# Altium schematic sheet MiniPC_Func.SchDoc: MiniPC Block Diagram
size D; DocumentNumber: 1; SheetNumber: 1; SheetTotal: 46
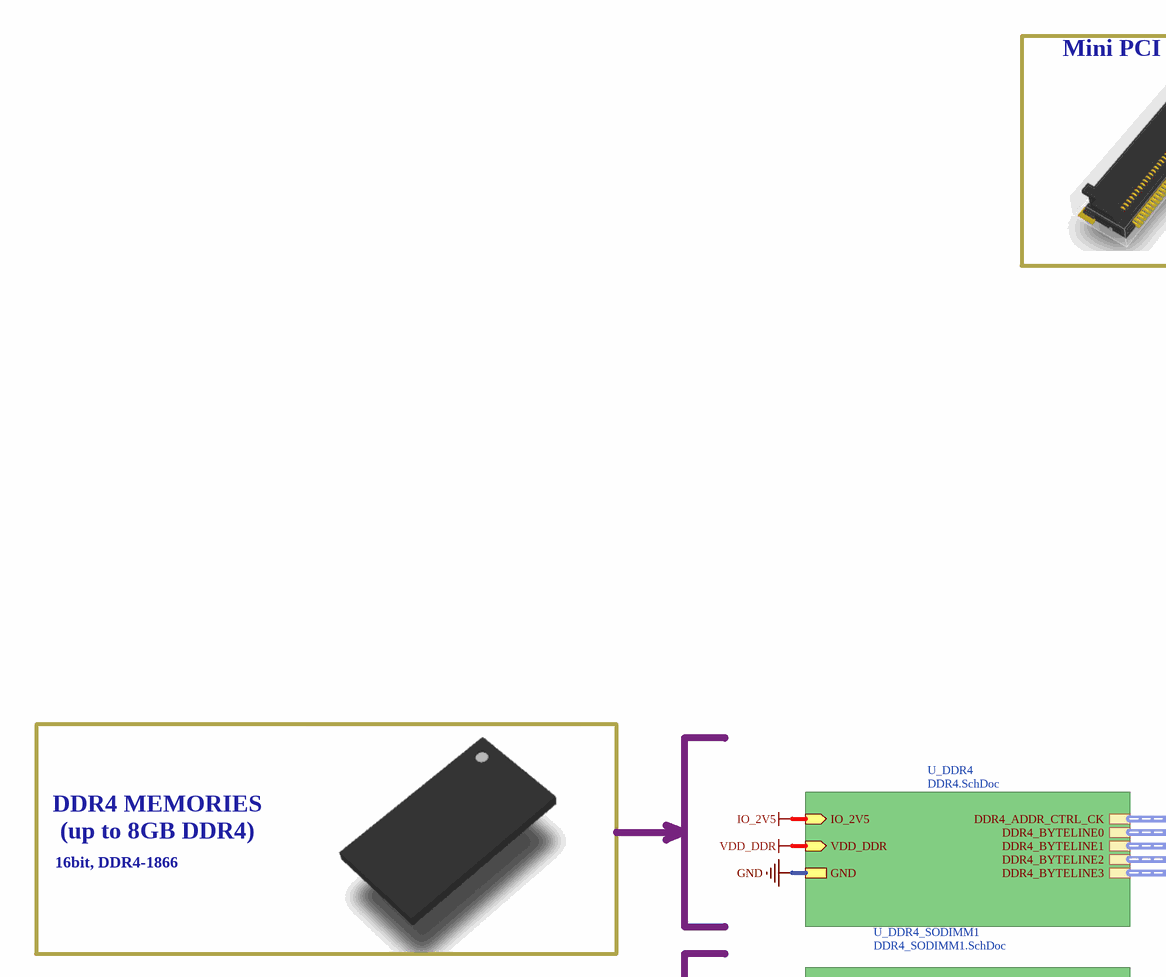
[diagram p0: MiniPC_Func.SchDoc, top left]
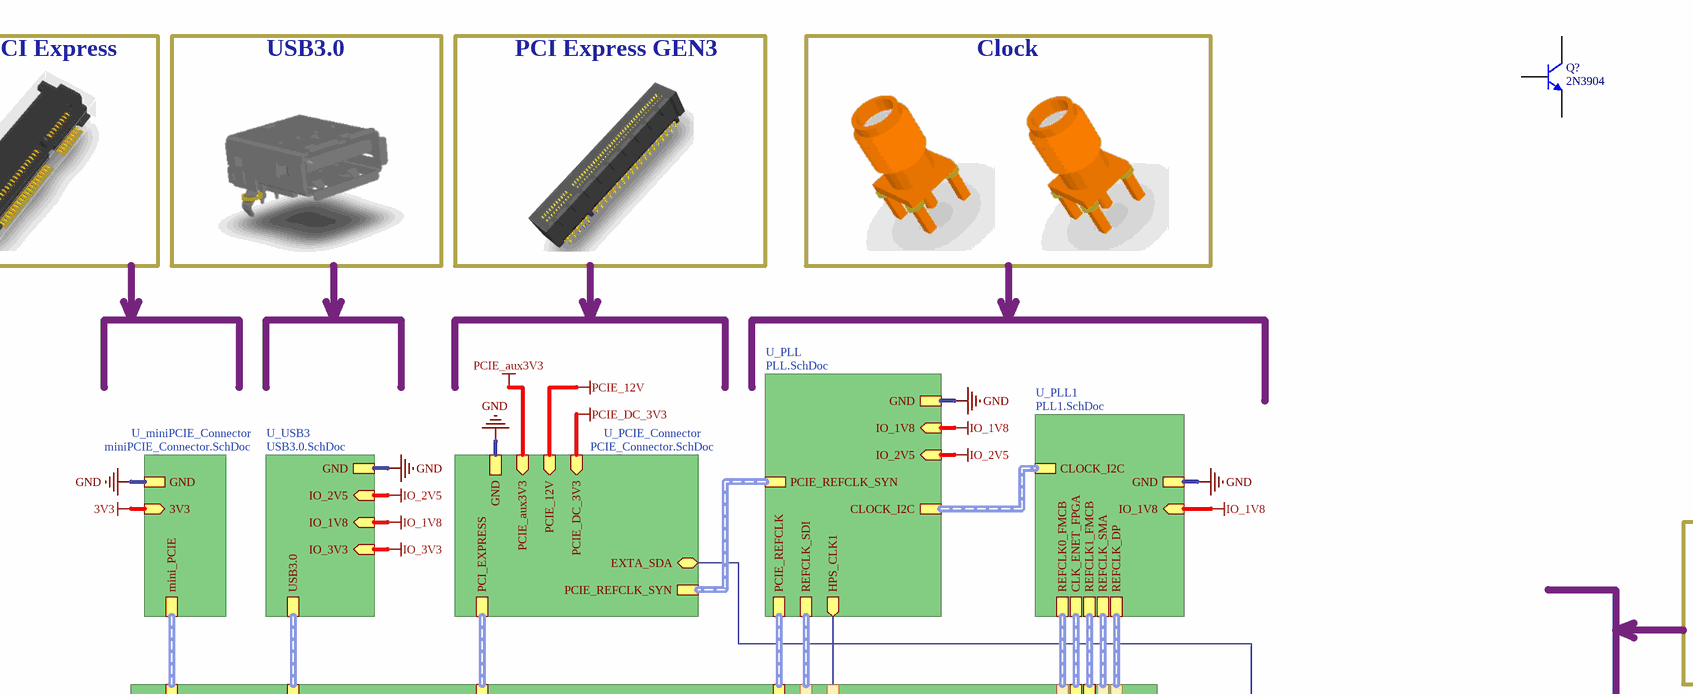
[diagram p1: MiniPC_Func.SchDoc, top middle]
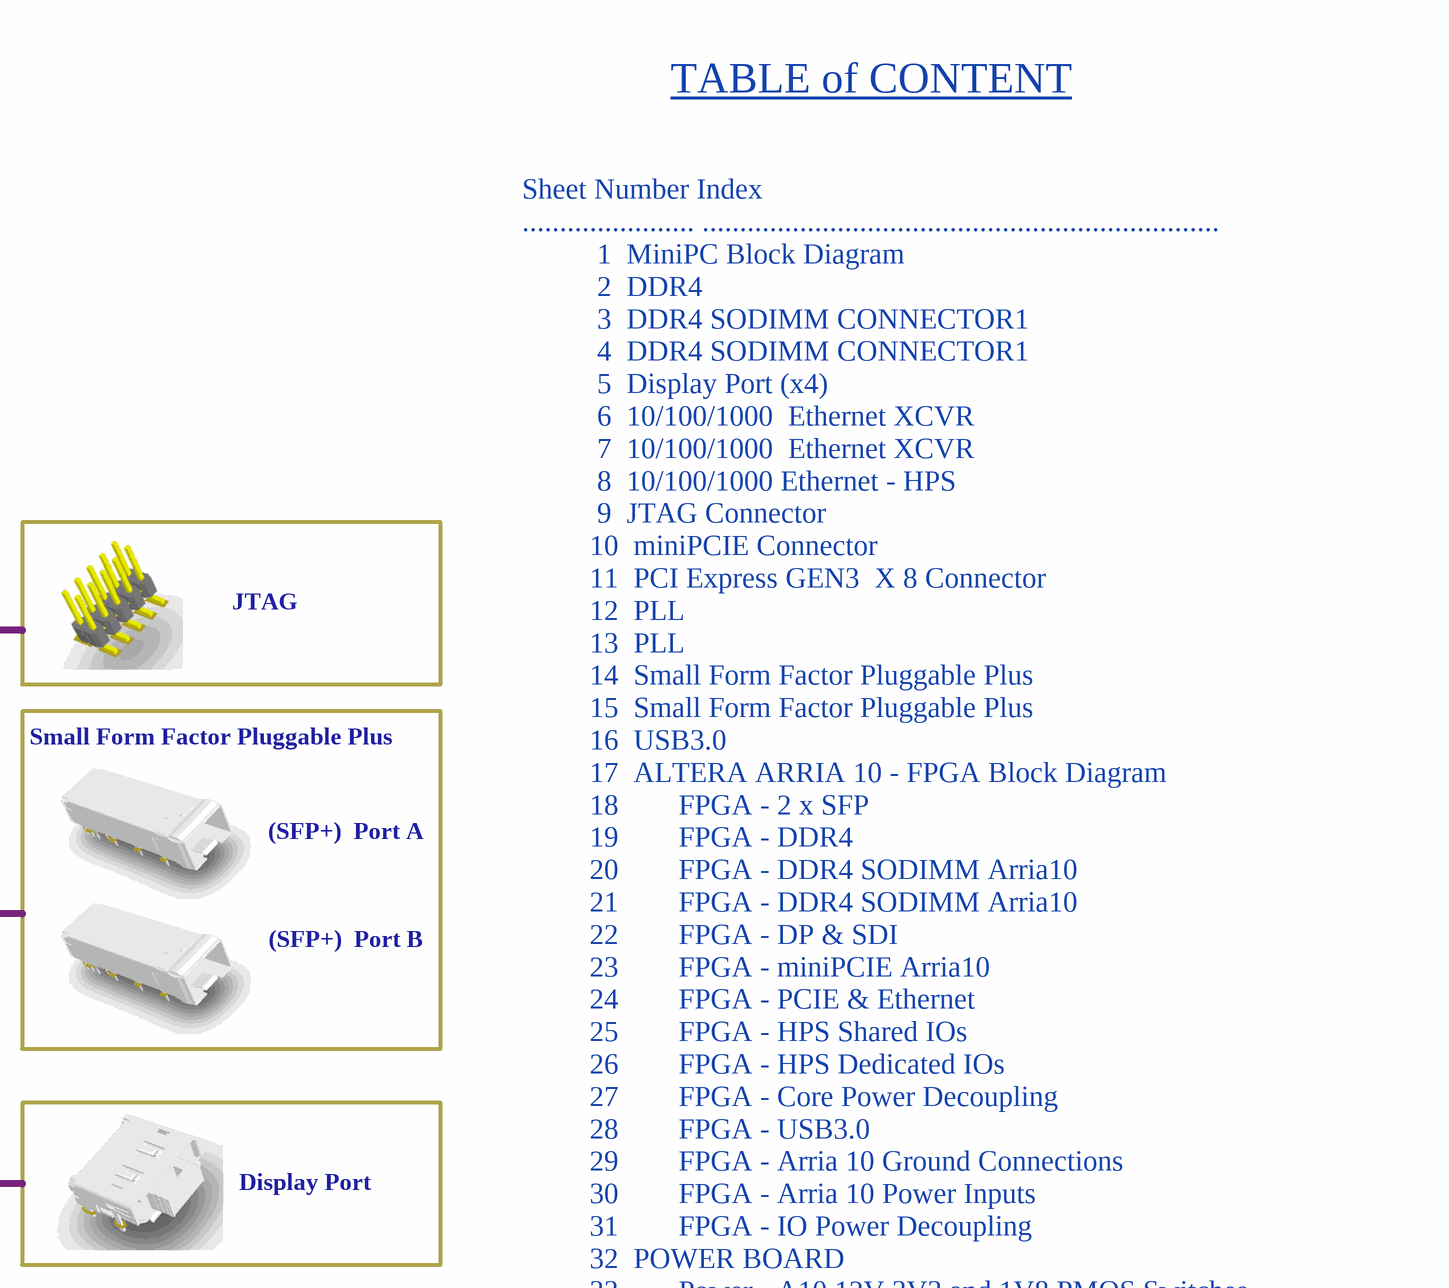
[diagram p2: MiniPC_Func.SchDoc, top right]
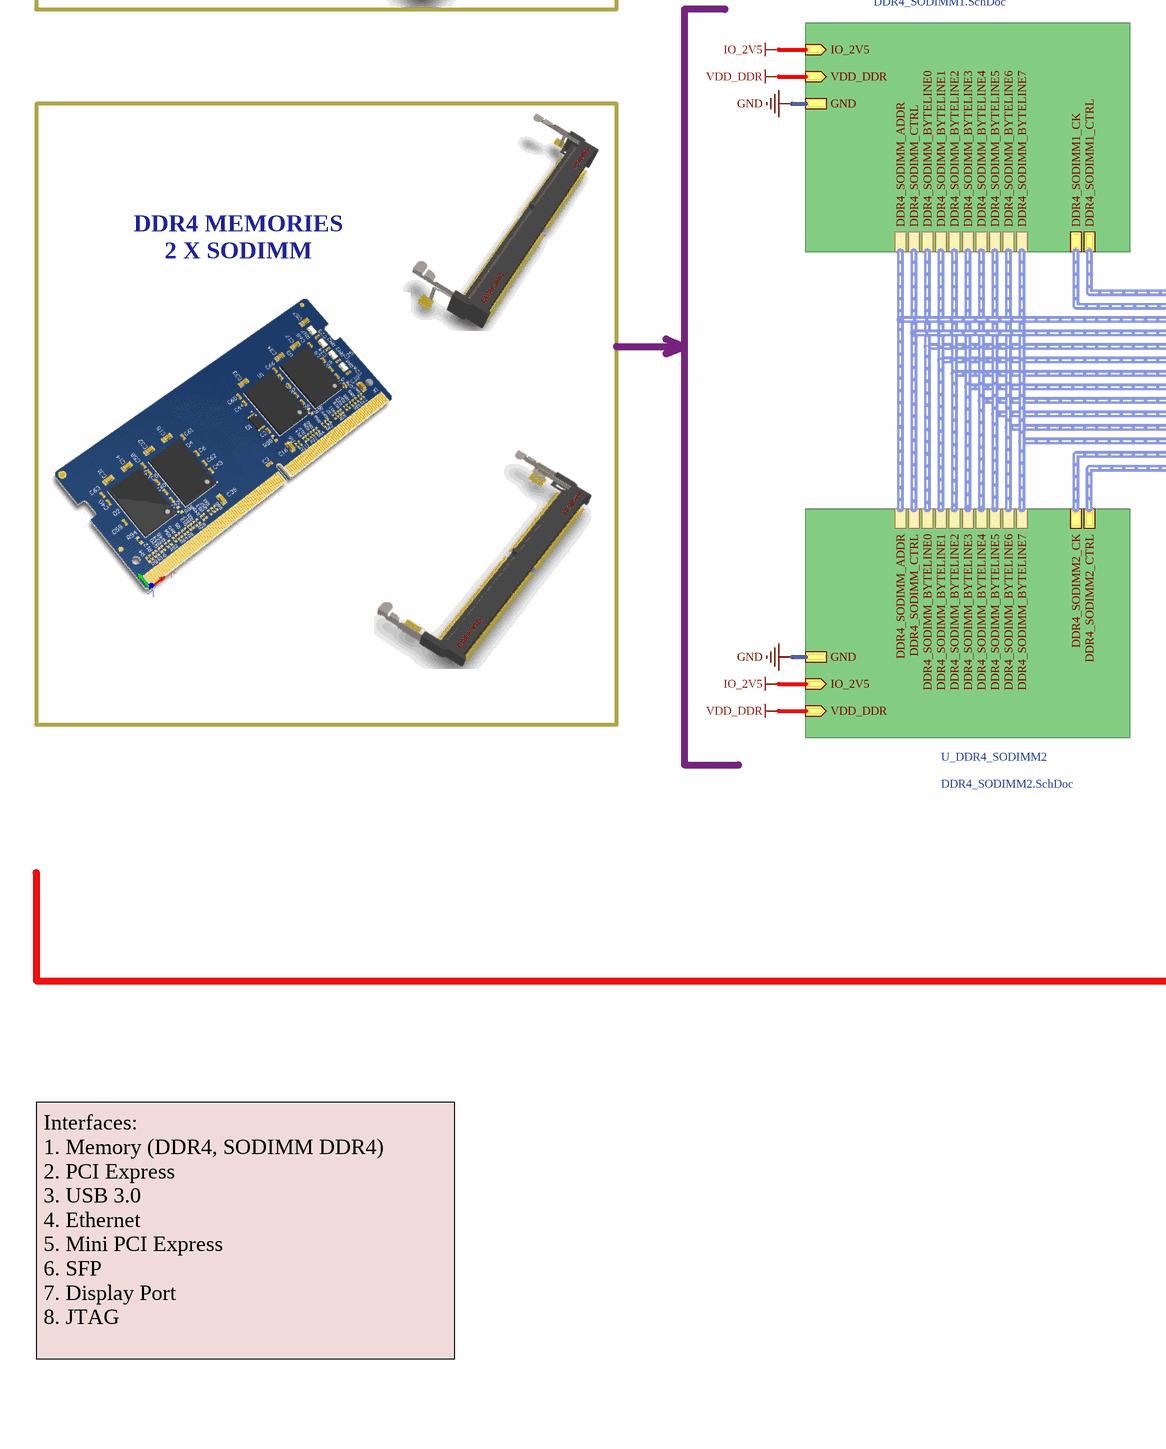
[diagram p3: MiniPC_Func.SchDoc, bottom left]
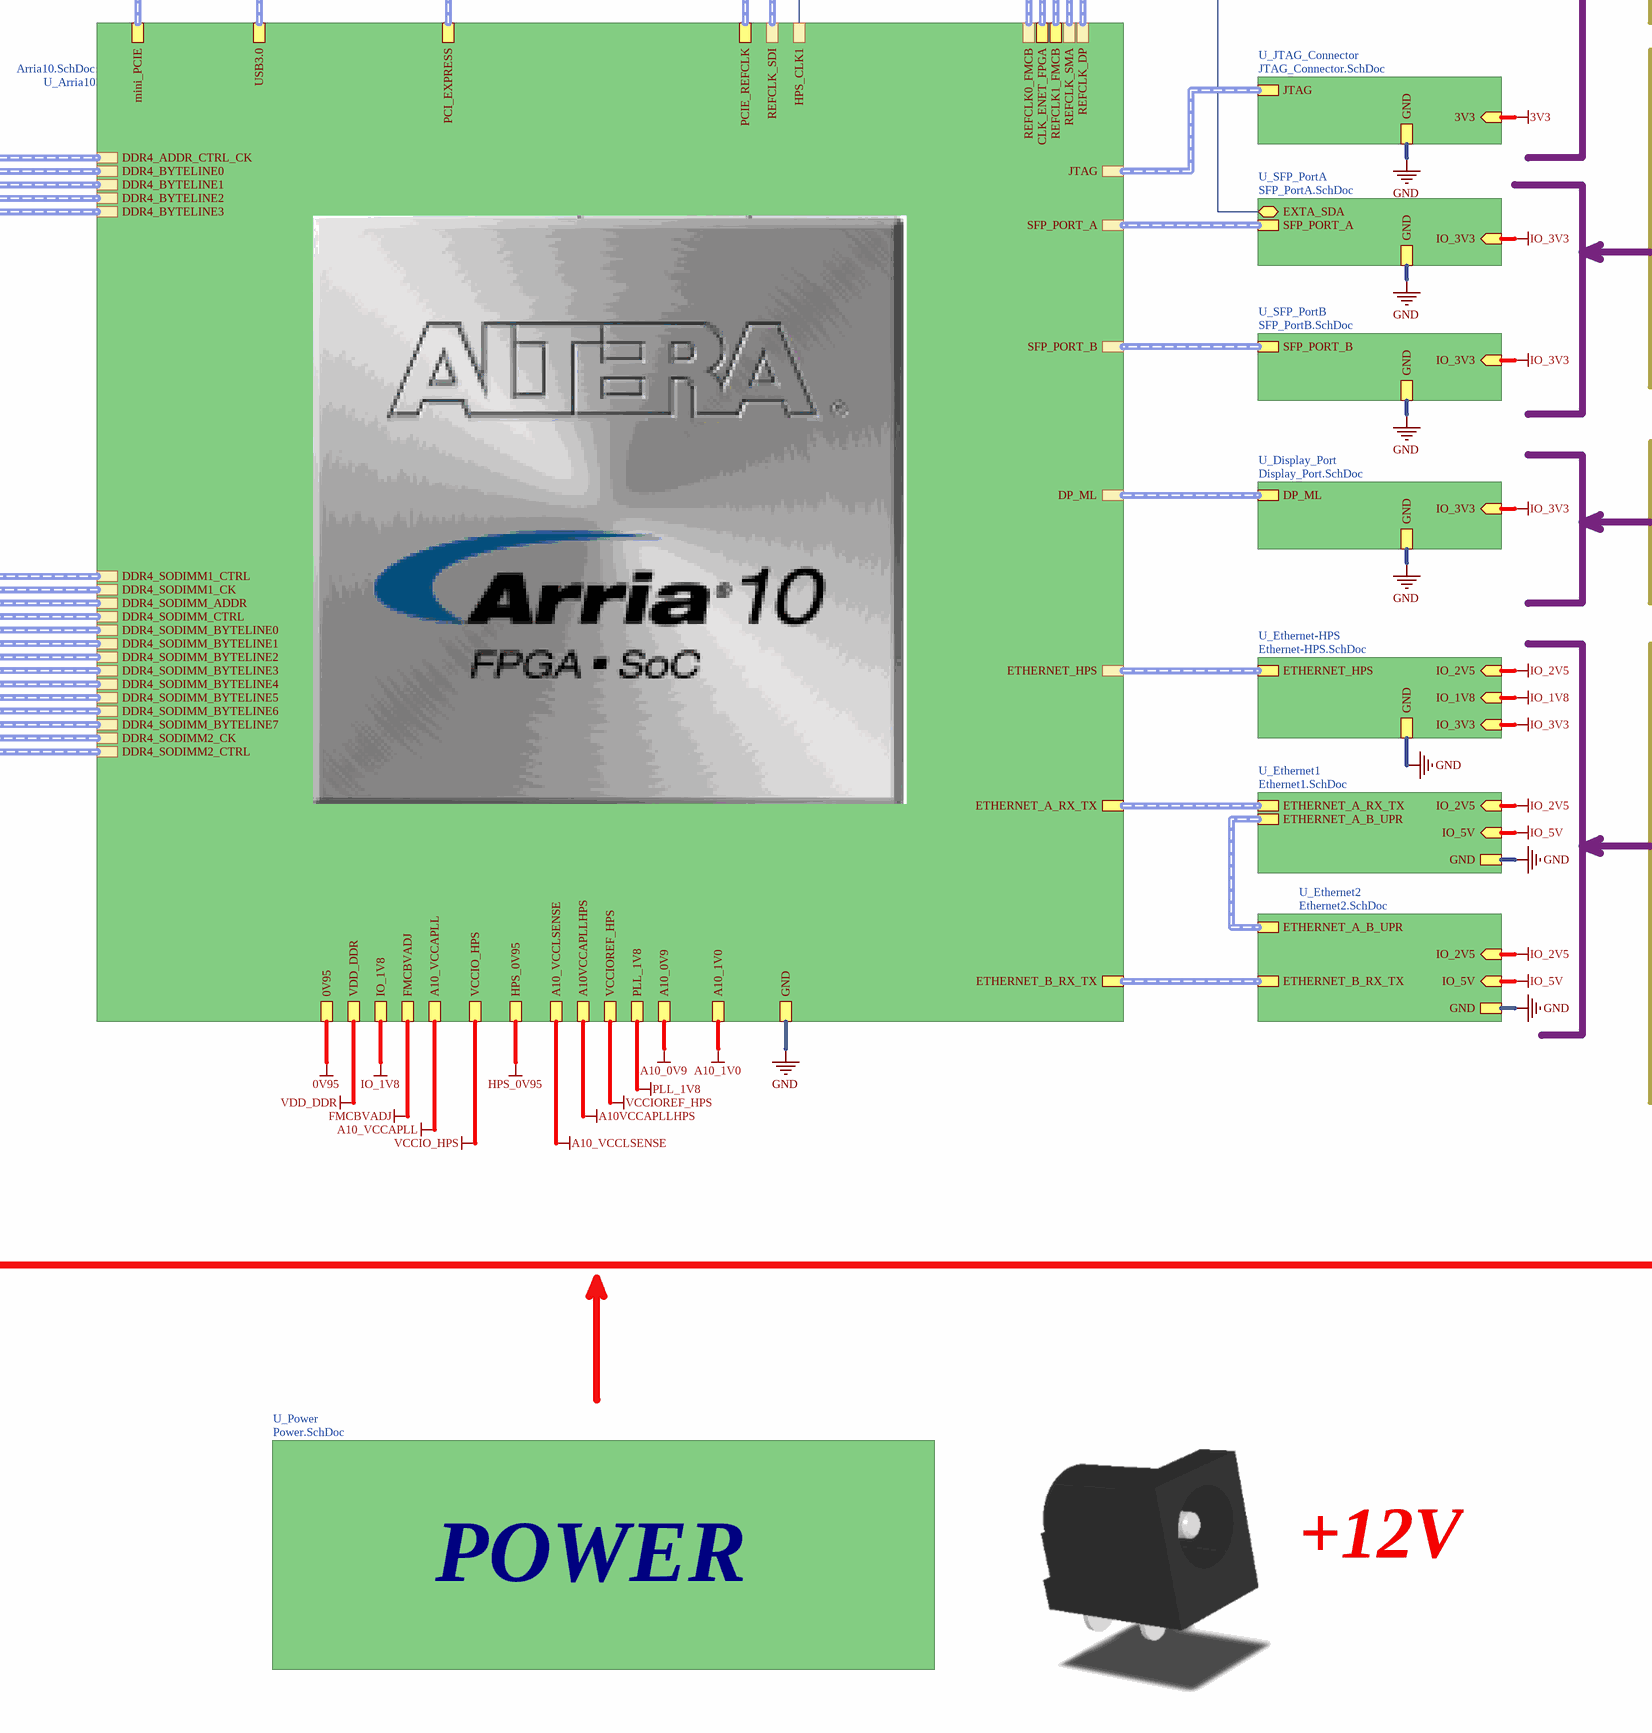
[diagram p4: MiniPC_Func.SchDoc, bottom middle]
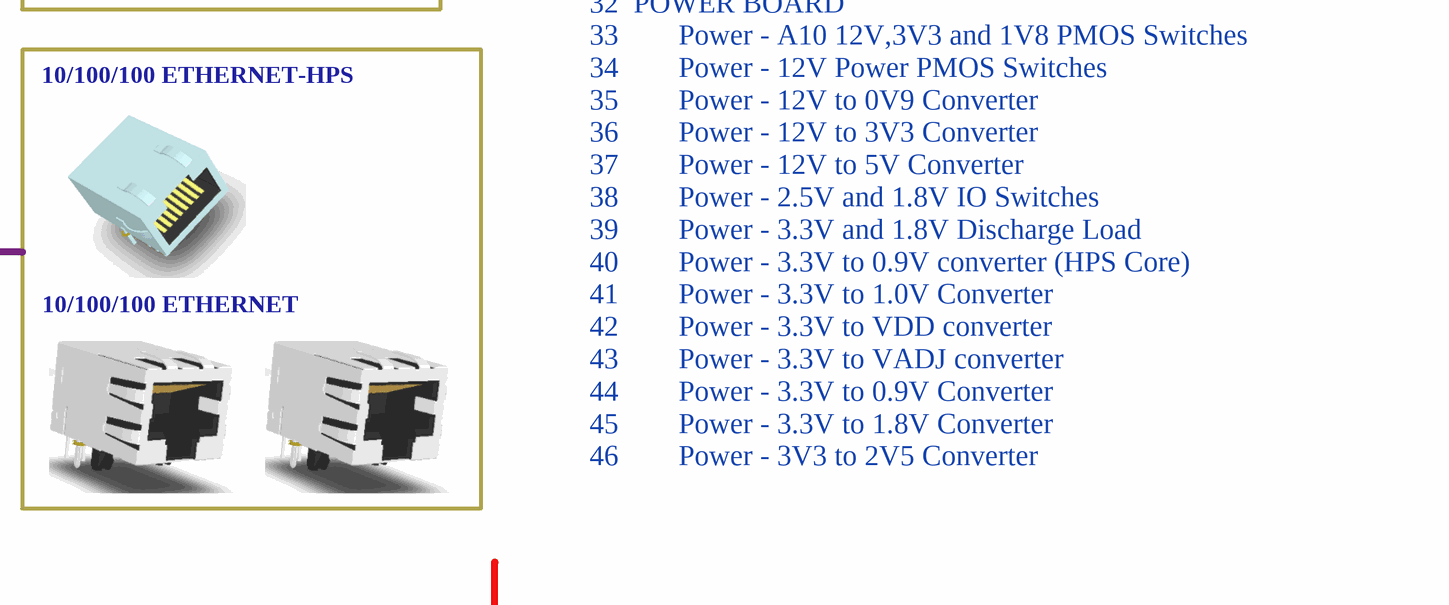
[diagram p5: MiniPC_Func.SchDoc, bottom right]

## Parts
Q?  2N3904  [TO-92A]

## Sub-sheets
U_Arria10 = Arria10.SchDoc: IO_1V8, VDD_DDR, FMCBVADJ, A10_VCCAPLL, HPS_0V95, VCCIO_HPS, VCCIOREF_HPS, A10VCCAPLLHPS, A10_VCCLSENSE, 0V95, PLL_1V8, A10_1V0, A10_0V9, DDR4_ADDR_CTRL_CK, DDR4_BYTELINE0, DDR4_BYTELINE1, DDR4_BYTELINE2, DDR4_BYTELINE3, DDR4_SODIMM_ADDR, DDR4_SODIMM1_CK, DDR4_SODIMM2_CK, DDR4_SODIMM_BYTELINE0, DDR4_SODIMM_BYTELINE1, DDR4_SODIMM_BYTELINE2, DDR4_SODIMM_BYTELINE3, DDR4_SODIMM_BYTELINE4, DDR4_SODIMM_BYTELINE5, DDR4_SODIMM_BYTELINE6, DDR4_SODIMM_BYTELINE7, DDR4_SODIMM_CTRL, DDR4_SODIMM1_CTRL, DDR4_SODIMM2_CTRL, mini_PCIE, JTAG, SFP_PORT_A, SFP_PORT_B, REFCLK0_FMCB, REFCLK_SMA, REFCLK_DP, REFCLK_SDI, DP_ML, ETHERNET_HPS, HPS_CLK1, USB3.0, ETHERNET_A_RX_TX, ETHERNET_B_RX_TX, PCI_EXPRESS, CLK_ENET_FPGA, PCIE_REFCLK, REFCLK1_FMCB, GND
U_DDR4 = DDR4.SchDoc: DDR4_ADDR_CTRL_CK (harness DDR4_ADDR_CTRL_CK), DDR4_BYTELINE0 (harness DDR4_BYTELINE0), DDR4_BYTELINE1 (harness DDR4_BYTELINE1), DDR4_BYTELINE2 (harness DDR4_BYTELINE2), DDR4_BYTELINE3 (harness DDR4_BYTELINE3), IO_2V5 (in), VDD_DDR (in), GND
U_DDR4_SODIMM1 = DDR4_SODIMM1.SchDoc: DDR4_SODIMM1_CTRL (harness DDR4_SODIMM1_CTRL), DDR4_SODIMM_BYTELINE0 (harness DDR4_SODIMM_BYTELINE0), DDR4_SODIMM_BYTELINE1 (harness DDR4_SODIMM_BYTELINE1), DDR4_SODIMM_BYTELINE2 (harness DDR4_SODIMM_BYTELINE2), DDR4_SODIMM_BYTELINE3 (harness DDR4_SODIMM_BYTELINE3), DDR4_SODIMM_BYTELINE4 (harness DDR4_SODIMM_BYTELINE4), DDR4_SODIMM_BYTELINE5 (harness DDR4_SODIMM_BYTELINE5), DDR4_SODIMM_BYTELINE6 (harness DDR4_SODIMM_BYTELINE6), DDR4_SODIMM_BYTELINE7 (harness DDR4_SODIMM_BYTELINE7), DDR4_SODIMM_ADDR (harness DDR4_SODIMM_ADDR), DDR4_SODIMM_CTRL (harness DDR4_SODIMM_CTRL), DDR4_SODIMM1_CK (harness DDR4_SODIMM1_CK), IO_2V5 (in), VDD_DDR (in), GND
U_DDR4_SODIMM2 = DDR4_SODIMM2.SchDoc: DDR4_SODIMM_ADDR (harness DDR4_SODIMM_ADDR), DDR4_SODIMM_CTRL (harness DDR4_SODIMM_CTRL), DDR4_SODIMM_BYTELINE0 (harness DDR4_SODIMM_BYTELINE0), DDR4_SODIMM_BYTELINE1 (harness DDR4_SODIMM_BYTELINE1), DDR4_SODIMM_BYTELINE2 (harness DDR4_SODIMM_BYTELINE2), DDR4_SODIMM_BYTELINE3 (harness DDR4_SODIMM_BYTELINE3), DDR4_SODIMM_BYTELINE4 (harness DDR4_SODIMM_BYTELINE4), DDR4_SODIMM_BYTELINE5 (harness DDR4_SODIMM_BYTELINE5), DDR4_SODIMM_BYTELINE6 (harness DDR4_SODIMM_BYTELINE6), DDR4_SODIMM_BYTELINE7 (harness DDR4_SODIMM_BYTELINE7), DDR4_SODIMM2_CTRL (harness DDR4_SODIMM2_CTRL), DDR4_SODIMM2_CK (harness DDR4_SODIMM2_CK), IO_2V5 (in), VDD_DDR (in), GND
U_Display_Port = Display_Port.SchDoc: DP_ML (harness DP_ML), IO_3V3 (in), GND
U_Ethernet1 = Ethernet1.SchDoc: ETHERNET_A_RX_TX (harness ETHERNET_A_RX_TX), ETHERNET_A_B_UPR (harness ETHERNET_A_B_UPR), IO_2V5 (in), IO_5V (in), GND
U_Ethernet2 = Ethernet2.SchDoc: ETHERNET_A_B_UPR (harness ETHERNET_A_B_UPR), ETHERNET_B_RX_TX (harness ETHERNET_B_RX_TX), IO_2V5 (in), IO_5V (in), GND
U_Ethernet-HPS = Ethernet-HPS.SchDoc: ETHERNET_HPS (harness ETHERNET_HPS), IO_1V8 (in), IO_2V5 (in), IO_3V3 (in), GND
U_JTAG_Connector = JTAG_Connector.SchDoc: JTAG (harness JTAG), 3V3 (in), GND
U_miniPCIE_Connector = miniPCIE_Connector.SchDoc: mini_PCIE (harness mini_PCIE), 3V3 (in), GND
U_PCIE_Connector = PCIE_Connector.SchDoc: EXTA_SDA (bidir), PCI_EXPRESS (harness PCI_EXPRESS), PCIE_REFCLK_SYN (harness PCIE_REFCLK_SYN), PCIE_DC_3V3 (in), PCIE_12V (in), PCIE_aux3V3 (in), GND
U_PLL = PLL.SchDoc: PCIE_REFCLK (harness REFCLK), PCIE_REFCLK_SYN (harness PCIE_REFCLK_SYN), REFCLK_SDI (harness REFCLK_SDI), HPS_CLK1 (out), CLOCK_I2C (harness CLOCK_I2C), IO_2V5 (in), IO_1V8 (in), GND
U_PLL1 = PLL1.SchDoc: REFCLK0_FMCB (harness REFCLK0_FMCB), CLK_ENET_FPGA (harness CLK_ENET), REFCLK1_FMCB (harness REFCLK1_FMCB), REFCLK_SMA (harness REFCLK_SMA), REFCLK_DP (harness REFCLK_DP), CLOCK_I2C (harness CLOCK_I2C), IO_1V8 (in), GND
U_Power = Power.SchDoc: no entries
U_SFP_PortA = SFP_PortA.SchDoc: EXTA_SDA (bidir), SFP_PORT_A (harness SFP_PORT_A), IO_3V3 (in), GND
U_SFP_PortB = SFP_PortB.SchDoc: SFP_PORT_B (harness SFP_PORT_B), IO_3V3 (in), GND
U_USB3 = USB3.0.SchDoc: USB3.0 (harness USB3.0), IO_1V8 (in), IO_2V5 (in), IO_3V3 (in), GND

## Nets
0V95: sheet U_Arria10/0V95
3V3: sheet U_JTAG_Connector/3V3, sheet U_miniPCIE_Connector/3V3
A10_0V9: sheet U_Arria10/A10_0V9
A10_1V0: sheet U_Arria10/A10_1V0
A10_VCCAPLL: sheet U_Arria10/A10_VCCAPLL
A10_VCCLSENSE: sheet U_Arria10/A10_VCCLSENSE
A10VCCAPLLHPS: sheet U_Arria10/A10VCCAPLLHPS
FMCBVADJ: sheet U_Arria10/FMCBVADJ
GND: sheet U_Arria10/GND, sheet U_DDR4/GND, sheet U_DDR4_SODIMM1/GND, sheet U_DDR4_SODIMM2/GND, sheet U_Ethernet-HPS/GND, sheet U_SFP_PortA/GND, sheet U_SFP_PortB/GND, sheet U_JTAG_Connector/GND, sheet U_Display_Port/GND, sheet U_Ethernet1/GND, sheet U_Ethernet2/GND, sheet U_miniPCIE_Connector/GND, sheet U_USB3/GND, sheet U_PCIE_Connector/GND, sheet U_PLL1/GND, sheet U_PLL/GND
HPS_0V95: sheet U_Arria10/HPS_0V95
IO_1V8: sheet U_Arria10/IO_1V8, sheet U_Ethernet-HPS/IO_1V8, sheet U_USB3/IO_1V8, sheet U_PLL1/IO_1V8, sheet U_PLL/IO_1V8
IO_2V5: sheet U_DDR4/IO_2V5, sheet U_DDR4_SODIMM1/IO_2V5, sheet U_DDR4_SODIMM2/IO_2V5, sheet U_Ethernet-HPS/IO_2V5, sheet U_Ethernet1/IO_2V5, sheet U_Ethernet2/IO_2V5, sheet U_USB3/IO_2V5, sheet U_PLL/IO_2V5
IO_3V3: sheet U_Ethernet-HPS/IO_3V3, sheet U_SFP_PortA/IO_3V3, sheet U_SFP_PortB/IO_3V3, sheet U_Display_Port/IO_3V3, sheet U_USB3/IO_3V3
IO_5V: sheet U_Ethernet1/IO_5V, sheet U_Ethernet2/IO_5V
PCIE_12V: sheet U_PCIE_Connector/PCIE_12V
PCIE_aux3V3: sheet U_PCIE_Connector/PCIE_aux3V3
PCIE_DC_3V3: sheet U_PCIE_Connector/PCIE_DC_3V3
PLL_1V8: sheet U_Arria10/PLL_1V8
VCCIO_HPS: sheet U_Arria10/VCCIO_HPS
VCCIOREF_HPS: sheet U_Arria10/VCCIOREF_HPS
VDD_DDR: sheet U_Arria10/VDD_DDR, sheet U_DDR4/VDD_DDR, sheet U_DDR4_SODIMM1/VDD_DDR, sheet U_DDR4_SODIMM2/VDD_DDR
(unnamed): sheet U_Arria10/HPS_CLK1, sheet U_PLL/HPS_CLK1
(unnamed): sheet U_SFP_PortA/EXTA_SDA, sheet U_PCIE_Connector/EXTA_SDA

Not connected (* = marked no-connect by the designer): Q? 1(E) 2(B) 3(C)

## Buses and harness runs
harness sheet U_Arria10/CLK_ENET_FPGA = sheet U_PLL1/CLK_ENET_FPGA
harness sheet U_Arria10/DDR4_ADDR_CTRL_CK = sheet U_DDR4/DDR4_ADDR_CTRL_CK
harness sheet U_Arria10/DDR4_BYTELINE0 = sheet U_DDR4/DDR4_BYTELINE0
harness sheet U_Arria10/DDR4_BYTELINE1 = sheet U_DDR4/DDR4_BYTELINE1
harness sheet U_Arria10/DDR4_BYTELINE2 = sheet U_DDR4/DDR4_BYTELINE2
harness sheet U_Arria10/DDR4_BYTELINE3 = sheet U_DDR4/DDR4_BYTELINE3
harness sheet U_Arria10/DDR4_SODIMM1_CK = sheet U_DDR4_SODIMM1/DDR4_SODIMM1_CK
harness sheet U_Arria10/DDR4_SODIMM1_CTRL = sheet U_DDR4_SODIMM1/DDR4_SODIMM1_CTRL
harness sheet U_Arria10/DDR4_SODIMM2_CK = sheet U_DDR4_SODIMM2/DDR4_SODIMM2_CK
harness sheet U_Arria10/DDR4_SODIMM2_CTRL = sheet U_DDR4_SODIMM2/DDR4_SODIMM2_CTRL
harness sheet U_Arria10/DDR4_SODIMM_ADDR = sheet U_DDR4_SODIMM1/DDR4_SODIMM_ADDR = sheet U_DDR4_SODIMM2/DDR4_SODIMM_ADDR
harness sheet U_Arria10/DDR4_SODIMM_BYTELINE0 = sheet U_DDR4_SODIMM1/DDR4_SODIMM_BYTELINE0 = sheet U_DDR4_SODIMM2/DDR4_SODIMM_BYTELINE0
harness sheet U_Arria10/DDR4_SODIMM_BYTELINE1 = sheet U_DDR4_SODIMM1/DDR4_SODIMM_BYTELINE1 = sheet U_DDR4_SODIMM2/DDR4_SODIMM_BYTELINE1
harness sheet U_Arria10/DDR4_SODIMM_BYTELINE2 = sheet U_DDR4_SODIMM1/DDR4_SODIMM_BYTELINE2 = sheet U_DDR4_SODIMM2/DDR4_SODIMM_BYTELINE2
harness sheet U_Arria10/DDR4_SODIMM_BYTELINE3 = sheet U_DDR4_SODIMM1/DDR4_SODIMM_BYTELINE3 = sheet U_DDR4_SODIMM2/DDR4_SODIMM_BYTELINE3
harness sheet U_Arria10/DDR4_SODIMM_BYTELINE4 = sheet U_DDR4_SODIMM1/DDR4_SODIMM_BYTELINE4 = sheet U_DDR4_SODIMM2/DDR4_SODIMM_BYTELINE4
harness sheet U_Arria10/DDR4_SODIMM_BYTELINE5 = sheet U_DDR4_SODIMM1/DDR4_SODIMM_BYTELINE5 = sheet U_DDR4_SODIMM2/DDR4_SODIMM_BYTELINE5
harness sheet U_Arria10/DDR4_SODIMM_BYTELINE6 = sheet U_DDR4_SODIMM1/DDR4_SODIMM_BYTELINE6 = sheet U_DDR4_SODIMM2/DDR4_SODIMM_BYTELINE6
harness sheet U_Arria10/DDR4_SODIMM_BYTELINE7 = sheet U_DDR4_SODIMM1/DDR4_SODIMM_BYTELINE7 = sheet U_DDR4_SODIMM2/DDR4_SODIMM_BYTELINE7
harness sheet U_Arria10/DDR4_SODIMM_CTRL = sheet U_DDR4_SODIMM1/DDR4_SODIMM_CTRL = sheet U_DDR4_SODIMM2/DDR4_SODIMM_CTRL
harness sheet U_Arria10/DP_ML = sheet U_Display_Port/DP_ML
harness sheet U_Arria10/ETHERNET_A_RX_TX = sheet U_Ethernet1/ETHERNET_A_RX_TX
harness sheet U_Arria10/ETHERNET_B_RX_TX = sheet U_Ethernet2/ETHERNET_B_RX_TX
harness sheet U_Arria10/ETHERNET_HPS = sheet U_Ethernet-HPS/ETHERNET_HPS
harness sheet U_Arria10/JTAG = sheet U_JTAG_Connector/JTAG
harness sheet U_Arria10/mini_PCIE = sheet U_miniPCIE_Connector/mini_PCIE
harness sheet U_Arria10/PCI_EXPRESS = sheet U_PCIE_Connector/PCI_EXPRESS
harness sheet U_Arria10/PCIE_REFCLK = sheet U_PLL/PCIE_REFCLK
harness sheet U_Arria10/REFCLK0_FMCB = sheet U_PLL1/REFCLK0_FMCB
harness sheet U_Arria10/REFCLK1_FMCB = sheet U_PLL1/REFCLK1_FMCB
harness sheet U_Arria10/REFCLK_DP = sheet U_PLL1/REFCLK_DP
harness sheet U_Arria10/REFCLK_SDI = sheet U_PLL/REFCLK_SDI
harness sheet U_Arria10/REFCLK_SMA = sheet U_PLL1/REFCLK_SMA
harness sheet U_Arria10/SFP_PORT_A = sheet U_SFP_PortA/SFP_PORT_A
harness sheet U_Arria10/SFP_PORT_B = sheet U_SFP_PortB/SFP_PORT_B
harness sheet U_Arria10/USB3.0 = sheet U_USB3/USB3.0
harness sheet U_Ethernet1/ETHERNET_A_B_UPR = sheet U_Ethernet2/ETHERNET_A_B_UPR
harness sheet U_PCIE_Connector/PCIE_REFCLK_SYN = sheet U_PLL/PCIE_REFCLK_SYN
harness sheet U_PLL1/CLOCK_I2C = sheet U_PLL/CLOCK_I2C

## Notes on the sheet
- Mini PCI Express
- USB3.0
- PCI Express GEN3
- Clock
- TABLE of CONTENT
- JTAG
- Small Form Factor Pluggable Plus
- DDR4 MEMORIES
- 16bit, DDR4-1866
- (up to 8GB DDR4)
- (SFP+)  Port A
- (SFP+)  Port B
- 2 X SODIMM
- Display Port
- 10/100/100 ETHERNET-HPS
- 10/100/100 ETHERNET
- Sheet Number	Index
  .......................	.....................................................................
  1		MiniPC Block Diagram
  2		DDR4
  3		DDR4 SODIMM CONNECTOR1
  4		DDR4 SODIMM CONNECTOR1
  5		Display Port (x4)
  6		10/100/1000  Ethernet XCVR
  7		10/100/1000  Ethernet XCVR
  8		10/100/1000 Ethernet - HPS
  9		JTAG Connector
  10		miniPCIE Connector
  11		PCI Express GEN3  X 8 Connector
  12		PLL
  13		PLL
  14		Small Form Factor Pluggable Plus
  15		Small Form Factor Pluggable Plus
  16		USB3.0
  17		ALTERA ARRIA 10 - FPGA Block Diagram
  18		      FPGA - 2 x SFP
  19		      FPGA - DDR4
  20		      FPGA - DDR4 SODIMM Arria10
  21		      FPGA - DDR4 SODIMM Arria10
  22		      FPGA - DP & SDI
  23		      FPGA - miniPCIE Arria10
  24		      FPGA - PCIE & Ethernet
  25		      FPGA - HPS Shared IOs
  26		      FPGA - HPS Dedicated IOs
  27		      FPGA - Core Power Decoupling
  28		      FPGA - USB3.0
  29		      FPGA - Arria 10 Ground Connections
  30		      FPGA - Arria 10 Power Inputs
  31		      FPGA - IO Power Decoupling
  32		POWER BOARD
  33		      Power - A10 12V,3V3 and 1V8 PMOS Switches
  34		      Power - 12V Power PMOS Switches
  35		      Power - 12V to 0V9 Converter
  36		      Power - 12V to 3V3 Converter
  37		      Power - 12V to 5V Converter
  38		      Power - 2.5V and 1.8V IO Switches
  39		      Power - 3.3V and 1.8V Discharge Load
  40		      Power - 3.3V to 0.9V converter (HPS Core)
  41		      Power - 3.3V to 1.0V Converter
  42		      Power - 3.3V to VDD converter
  43		      Power - 3.3V to VADJ converter
  44		      Power - 3.3V to 0.9V Converter
  45		      Power - 3.3V to 1.8V Converter
  46		      Power - 3V3 to 2V5 Converter
- +12V
- Interfaces:
  1. Memory (DDR4, SODIMM DDR4)
  2. PCI Express
  3. USB 3.0
  4. Ethernet
  5. Mini PCI Express
  6. SFP
  7. Display Port
  8. JTAG
- POWER
- Title
- Size:
- Date:
- File:
- B
- Number:
- Time:
- Revision:
- Sheet
- of

## Library data of the parts
Q? = 2N3904: NPN General Purpose Amplifier; Published: 8-Jun-2000; LatestRevisionDate: 15-Jan-2003; LatestRevisionNote: PCB Footprint 'BCY-W3/D4.7' replaced; DatasheetVersion: 1997; PackageVersion: Sep-1998; PackageReference: TO-92A; Publisher: Altium Limited; PackageDescription: TO, Flat Index; 3 In-Line, Axial Leads; Body Dia. 4.5mm; Leads 0.51 x 0.48 mm (max); ComponentLink1Description: Manufacturer Link; ComponentLink1URL: http://www.fairchildsemi.com/; ComponentLink2Description: Datasheet; ComponentLink2URL: http://www.fairchildsemi.com/ds/2N%2F2N3904.pdf